# EAGLE schematic mcuboard (EAGLE 7.1.0)
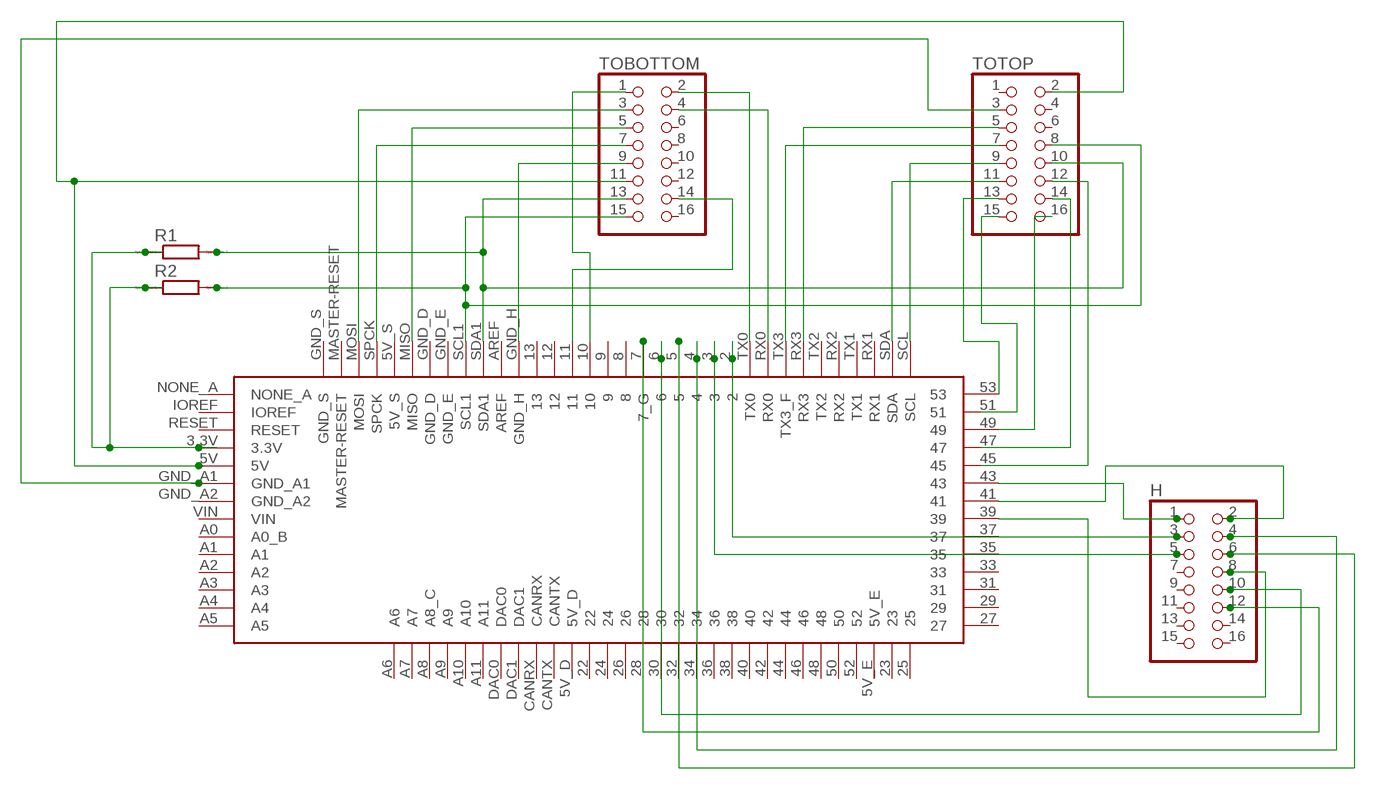
[diagram p0: schematic, sheet 1]

## Parts
H  PINHD-2X8  [2X08]
R1  R-EU_0207_12  [0207/12]
R2  R-EU_0207_12  [0207/12]
TOBOTTOM  PINHD-2X8  [2X08]
TOTOP  PINHD-2X8  [2X08]
U$1  IDUINO1  [IDUINO_PAC]

## Nets
N$1: TOBOTTOM.7 U$1.SPCK
N$2: TOBOTTOM.3 U$1.MOSI
N$3: TOBOTTOM.5 U$1.MISO
N$4: TOBOTTOM.9 U$1.GND_H
N$5: TOBOTTOM.11 TOTOP.2 U$1.5V
N$6: R1.2 TOBOTTOM.13 TOTOP.10 U$1.SDA1
N$7: R2.2 TOBOTTOM.15 TOTOP.8 U$1.SCL1
N$8: TOBOTTOM.2 U$1.TX0
N$9: TOTOP.3 U$1.GND_A1
N$10: TOBOTTOM.4 U$1.RX0
N$11: TOBOTTOM.14 U$1.11
N$12: TOBOTTOM.1 U$1.10
N$13: TOTOP.5 U$1.RX3
N$14: TOTOP.7 U$1.TX3(TX3_F)
N$15: TOTOP.9 U$1.SCL
N$16: TOTOP.11 U$1.SDA
N$17: R1.1 R2.1 U$1.3.3V
N$18: TOTOP.13 U$1.53
N$19: TOTOP.15
N$20: TOTOP.16 U$1.49
N$21: TOTOP.14
N$22: TOTOP.12
N$23: H.1 U$1.43
N$24: H.8 U$1.39
N$25: H.3 U$1.2
N$26: H.5 U$1.3
N$27: H.4 U$1.4
N$29: H.2 U$1.41
N$30: H.10 U$1.6
N$31: H.12 U$1.7(7_G)
N$33: H.6 U$1.5
Unconnected: H.7 H.9 H.11 H.13 H.14 H.15 H.16 TOBOTTOM.6 TOBOTTOM.8 TOBOTTOM.10 TOBOTTOM.12 TOBOTTOM.16 TOTOP.1 TOTOP.4 TOTOP.6 U$1.5V_D U$1.5V_E U$1.5V_S U$1.8 U$1.9 U$1.12 U$1.13 U$1.22 U$1.23 U$1.24 U$1.25 U$1.26 U$1.27 U$1.28 U$1.29 U$1.30 U$1.31 U$1.32 U$1.33 U$1.34 U$1.35 U$1.36 U$1.37 U$1.38 U$1.40 U$1.42 U$1.44 U$1.45 U$1.46 U$1.47 U$1.48 U$1.50 U$1.51 U$1.52 U$1.A0(A0_B) U$1.A1 U$1.A2 U$1.A3 U$1.A4 U$1.A5 U$1.A6 U$1.A7 U$1.A8(A8_C) U$1.A9 U$1.A10 U$1.A11 U$1.AREF U$1.CANRX U$1.CANTX U$1.DAC0 U$1.DAC1 U$1.GND_A2 U$1.GND_D U$1.GND_E U$1.GND_S U$1.IOREF U$1.MASTER-RESET U$1.NONE_A U$1.RESET U$1.RX1 U$1.RX2 U$1.TX1 U$1.TX2 U$1.VIN

## Library data of the parts
H TOBOTTOM TOTOP = pinhead:PINHD-2X8: PIN HEADER
R1 R2 = resistor:R-EU_: RESISTOR, European symbol; SPICEPREFIX: R
U$1 = iduino:IDUINO